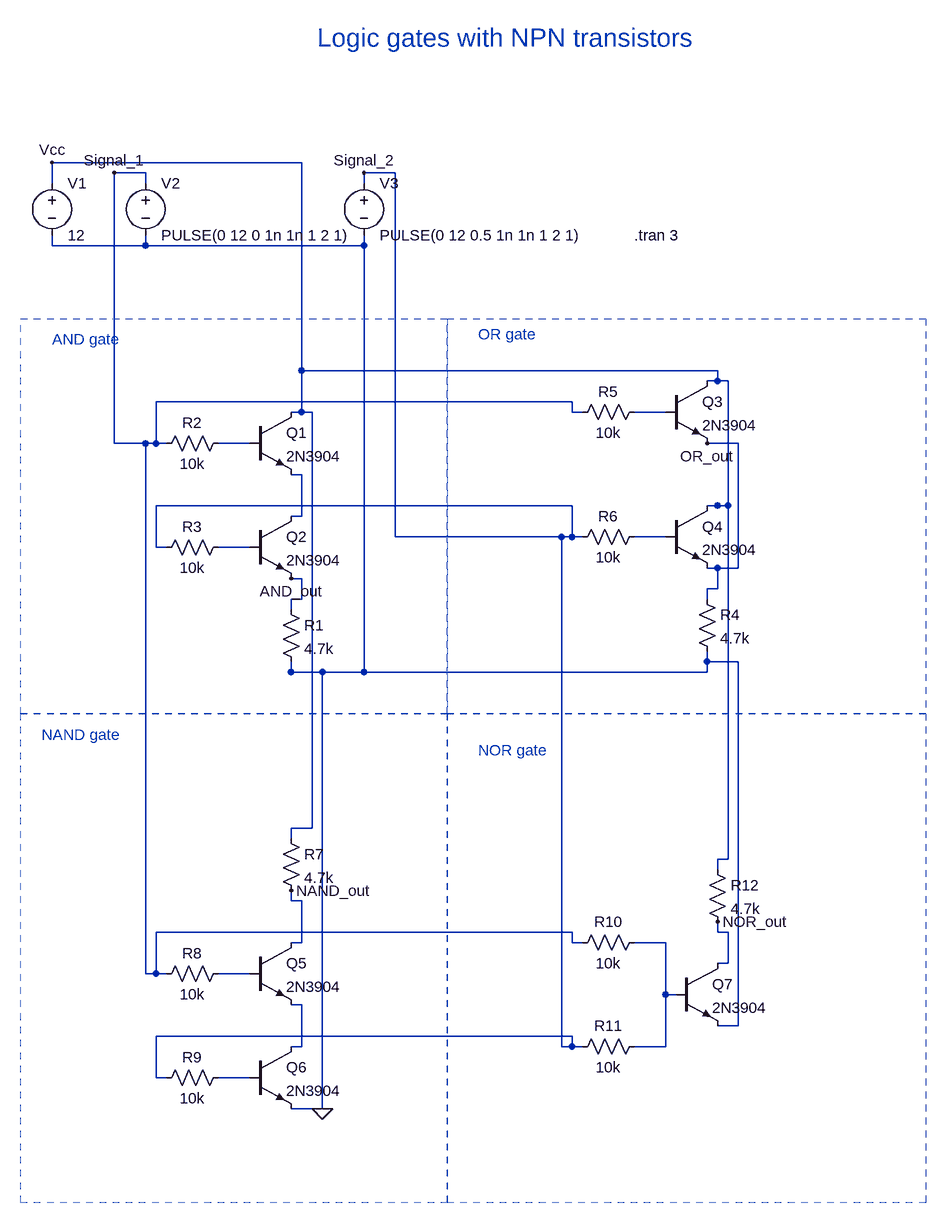
[diagram p0: schematic Logic-gates-transistors-BJTs.asc]
Logic-gates-transistors-BJTs.asc, the LTspice schematic file:
Version 4.1
SHEET 1 1140 1492
WIRE 160 1344 176 1344
WIRE 816 1216 832 1216
WIRE 160 656 160 672
WIRE 800 640 800 656
WIRE -208 0 -208 16
WIRE -64 0 -64 16
WIRE 272 0 272 16
WIRE 176 1344 208 1344
WIRE 208 1344 208 672
WIRE 208 672 160 672
WIRE 160 672 800 672
WIRE 800 672 800 656
WIRE 800 656 848 656
WIRE 848 656 848 1216
WIRE 848 1216 832 1216
WIRE 160 672 272 672
WIRE 272 672 272 16
WIRE 272 16 -64 16
WIRE -64 16 -208 16
FLAG 208 1344 0
WIRE 160 528 176 528
WIRE 160 576 160 560
WIRE 176 528 176 560
WIRE 176 560 160 560
FLAG 160 528 AND_out
WIRE 736 272 720 272
WIRE 688 272 704 272
WIRE 720 272 704 272
WIRE 96 320 80 320
WIRE 48 320 64 320
WIRE 80 320 64 320
WIRE 160 368 176 368
WIRE 160 432 176 432
WIRE 176 368 176 432
WIRE 736 464 720 464
WIRE 688 464 704 464
WIRE 720 464 704 464
WIRE 96 480 80 480
WIRE 48 480 64 480
WIRE 80 480 64 480
WIRE 752 1168 736 1168
WIRE 688 1088 704 1088
WIRE 688 1248 704 1248
WIRE 736 1168 736 1088
WIRE 736 1088 704 1088
WIRE 736 1168 736 1248
WIRE 736 1248 704 1248
WIRE 96 1136 80 1136
WIRE 48 1136 64 1136
WIRE 80 1136 64 1136
WIRE 160 1184 176 1184
WIRE 160 1248 176 1248
WIRE 176 1184 176 1248
WIRE 96 1296 80 1296
WIRE 48 1296 64 1296
WIRE 80 1296 64 1296
WIRE 160 1088 176 1088
WIRE 160 1008 160 1024
WIRE 176 1088 176 1024
WIRE 176 1024 160 1024
FLAG 160 1008 NAND_out
WIRE 816 1120 832 1120
WIRE 816 1056 816 1072
WIRE 832 1120 832 1072
WIRE 832 1072 816 1072
FLAG 816 1056 NOR_out
WIRE 800 320 816 320
WIRE 800 512 816 512
WIRE 800 560 800 544
WIRE 816 320 848 320
WIRE 848 320 848 512
WIRE 848 512 816 512
WIRE 816 512 816 544
WIRE 816 544 800 544
FLAG 800 320 OR_out
WIRE 608 1088 592 1088
WIRE -32 320 -48 320
WIRE 608 272 592 272
WIRE -32 1136 -48 1136
WIRE -64 -80 -64 -96
WIRE 592 1088 592 1072
WIRE 592 1072 -48 1072
WIRE -48 1072 -48 1136
WIRE -48 1136 -64 1136
WIRE -64 1136 -64 320
WIRE -64 320 -48 320
WIRE -48 320 -112 320
WIRE -112 320 -112 -96
WIRE -112 -96 -64 -96
WIRE -48 320 -48 256
WIRE -48 256 592 256
WIRE 592 256 592 272
FLAG -112 -96 Signal_1
WIRE 608 1248 592 1248
WIRE -32 480 -48 480
WIRE 608 464 592 464
WIRE -32 1296 -48 1296
WIRE 272 -80 272 -96
WIRE 592 1248 592 1232
WIRE 592 1232 -48 1232
WIRE -48 1232 -48 1296
WIRE 592 1248 576 1248
WIRE 576 1248 576 464
WIRE 576 464 592 464
WIRE 592 464 592 416
WIRE 592 416 -48 416
WIRE -48 416 -48 480
WIRE 592 464 320 464
WIRE 320 464 320 -96
WIRE 320 -96 272 -96
FLAG 272 -96 Signal_2
WIRE 160 272 176 272
WIRE 800 224 816 224
WIRE 800 416 816 416
WIRE 816 976 816 960
WIRE 160 928 160 912
WIRE -208 -80 -208 -96
WIRE 176 272 192 272
WIRE 192 272 192 912
WIRE 192 912 160 912
WIRE 176 272 176 208
WIRE 176 208 816 208
WIRE 816 208 816 224
WIRE 816 224 832 224
WIRE 832 224 832 416
WIRE 832 416 816 416
WIRE 816 416 832 416
WIRE 832 416 832 960
WIRE 832 960 816 960
WIRE 176 272 176 -112
WIRE 176 -112 -208 -112
WIRE -208 -112 -208 -96
FLAG -208 -112 Vcc
SYMBOL voltage -208 -96 R0
WINDOW 123 0 0 Left 0
WINDOW 39 0 0 Left 0
SYMATTR InstName V1
SYMATTR Value 12
SYMBOL voltage -64 -96 R0
WINDOW 123 0 0 Left 0
WINDOW 39 0 0 Left 0
SYMATTR InstName V2
SYMATTR Value PULSE(0 12 0 1n 1n 1 2 1)
SYMBOL voltage 272 -96 R0
WINDOW 123 0 0 Left 0
WINDOW 39 0 0 Left 0
SYMATTR InstName V3
SYMATTR Value PULSE(0 12 0.5 1n 1n 1 2 1)
SYMBOL npn 96 272 R0
SYMATTR InstName Q1
SYMATTR Value 2N3904
SYMBOL npn 96 432 R0
SYMATTR InstName Q2
SYMATTR Value 2N3904
SYMBOL res 144 560 R0
SYMATTR InstName R1
SYMATTR Value 4.7k
SYMBOL res 64 304 R90
WINDOW 0 0 56 VBottom 2
WINDOW 3 32 56 VTop 2
SYMATTR InstName R2
SYMATTR Value 10k
SYMBOL res 64 464 R90
WINDOW 0 0 56 VBottom 2
WINDOW 3 32 56 VTop 2
SYMATTR InstName R3
SYMATTR Value 10k
SYMBOL npn 736 224 R0
SYMATTR InstName Q3
SYMATTR Value 2N3904
SYMBOL npn 736 416 R0
SYMATTR InstName Q4
SYMATTR Value 2N3904
SYMBOL res 784 544 R0
SYMATTR InstName R4
SYMATTR Value 4.7k
SYMBOL res 704 256 R90
WINDOW 0 0 56 VBottom 2
WINDOW 3 32 56 VTop 2
SYMATTR InstName R5
SYMATTR Value 10k
SYMBOL res 704 448 R90
WINDOW 0 0 56 VBottom 2
WINDOW 3 32 56 VTop 2
SYMATTR InstName R6
SYMATTR Value 10k
SYMBOL npn 96 1088 R0
SYMATTR InstName Q5
SYMATTR Value 2N3904
SYMBOL npn 96 1248 R0
SYMATTR InstName Q6
SYMATTR Value 2N3904
SYMBOL res 144 912 R0
SYMATTR InstName R7
SYMATTR Value 4.7k
SYMBOL res 64 1120 R90
WINDOW 0 0 56 VBottom 2
WINDOW 3 32 56 VTop 2
SYMATTR InstName R8
SYMATTR Value 10k
SYMBOL res 64 1280 R90
WINDOW 0 0 56 VBottom 2
WINDOW 3 32 56 VTop 2
SYMATTR InstName R9
SYMATTR Value 10k
SYMBOL res 704 1072 R90
WINDOW 0 0 56 VBottom 2
WINDOW 3 32 56 VTop 2
SYMATTR InstName R10
SYMATTR Value 10k
SYMBOL res 704 1232 R90
WINDOW 0 0 56 VBottom 2
WINDOW 3 32 56 VTop 2
SYMATTR InstName R11
SYMATTR Value 10k
SYMBOL npn 752 1120 R0
SYMATTR InstName Q7
SYMATTR Value 2N3904
SYMBOL res 800 960 R0
SYMATTR InstName R12
SYMATTR Value 4.7k
TEXT 688 0 Left 2 !.tran 3
TEXT -224 768 Left 2 ;NAND gate
TEXT -208 160 Left 2 ;AND gate
TEXT 448 152 Left 2 ;OR gate
TEXT 200 -304 Left 4 ;Logic gates with NPN transistors
TEXT 448 792 Left 2 ;NOR gate
RECTANGLE Normal 400 736 -256 128 2
RECTANGLE Normal 1136 736 400 128 2
RECTANGLE Normal 400 1488 -256 736 2
RECTANGLE Normal 1136 1488 400 736 2

The netlist it stands for:
* Logic-gates-transistors-BJTs.asc
V1 Vcc 0 12
V2 Signal_1 0 PULSE(0 12 0 1n 1n 1 2 1)
V3 Signal_2 0 PULSE(0 12 0.5 1n 1n 1 2 1)
Q1 Vcc N002 N003 0 2N3904
Q2 N003 N005 AND_out 0 2N3904
R1 AND_out 0 4.7k
R2 N002 Signal_1 10k
R3 N005 Signal_2 10k
Q3 Vcc N001 OR_out 0 2N3904
Q4 Vcc N004 OR_out 0 2N3904
R4 OR_out 0 4.7k
R5 N001 Signal_1 10k
R6 N004 Signal_2 10k
Q5 NAND_out N007 N008 0 2N3904
Q6 N008 N009 0 0 2N3904
R7 Vcc NAND_out 4.7k
R8 N007 Signal_1 10k
R9 N009 Signal_2 10k
R10 N006 Signal_1 10k
R11 N006 Signal_2 10k
Q7 NOR_out N006 0 0 2N3904
R12 Vcc NOR_out 4.7k
.model NPN NPN
.model PNP PNP
.lib standard.bjt
.tran 3
* NAND gate
* AND gate
* OR gate
* Logic gates with NPN transistors
* NOR gate
.backanno
.end